# Altium schematic sheet Output_Digital.SchDoc
size A4
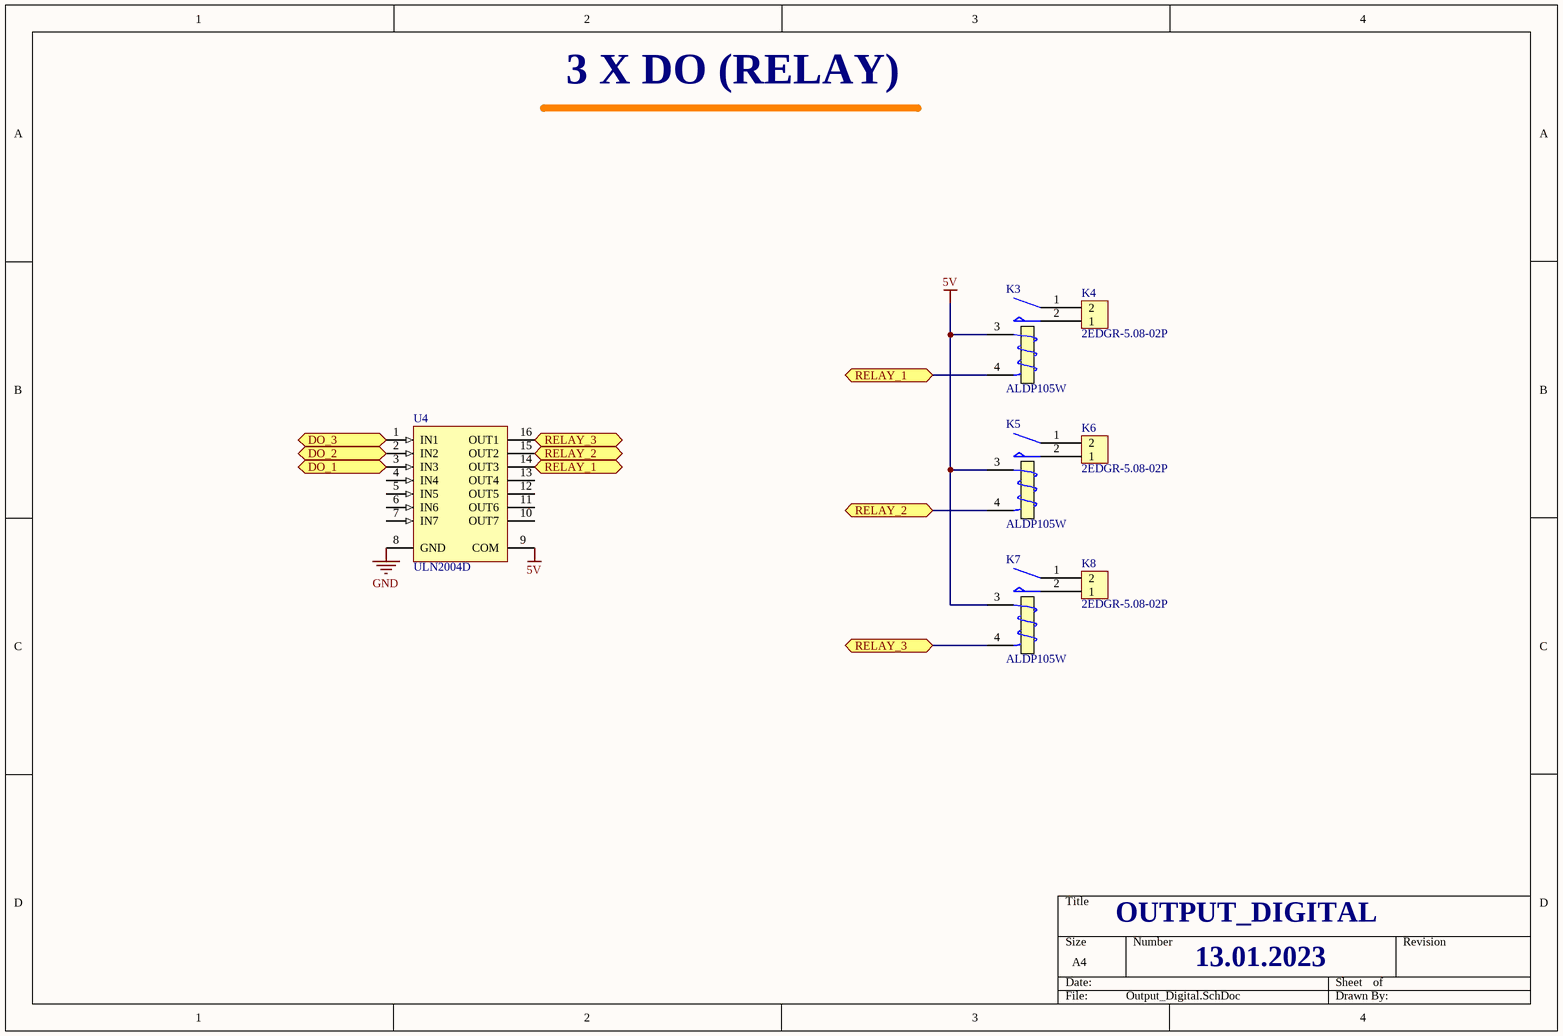
[diagram p0: Output_Digital.SchDoc]

## Parts
K3  ALDP105W  [RELAY_ALDP124W]
K4  2EDGR-5.08-02P  [CON_DG129_02P]
K5  ALDP105W  [RELAY_ALDP124W]
K6  2EDGR-5.08-02P  [CON_DG129_02P]
K7  ALDP105W  [RELAY_ALDP124W]
K8  2EDGR-5.08-02P  [CON_DG129_02P]
U4  ULN2004D  [SO16_M]

## Ports
DO_1, DO_2, DO_3, RELAY_1, RELAY_2, RELAY_3

## Nets
5V: K3.3(T1) K5.3(T1) K7.3(T1) U4.9(COM)
GND: U4.8(GND)
DO_1: U4.3(IN3) ; port DO_1
DO_2: U4.2(IN2) ; port DO_2
DO_3: U4.1(IN1) ; port DO_3
RELAY_1: K3.4(T2) U4.14(OUT3) ; port RELAY_1
RELAY_2: K5.4(T2) U4.15(OUT2) ; port RELAY_2
RELAY_3: K7.4(T2) U4.16(OUT1) ; port RELAY_3
NetK3_1: K3.1(COM) K4.2
NetK3_2: K3.2(NO) K4.1
NetK5_1: K5.1(COM) K6.2
NetK5_2: K5.2(NO) K6.1
NetK7_1: K7.1(COM) K8.2
NetK7_2: K7.2(NO) K8.1

Not connected (* = marked no-connect by the designer): U4 4(IN4) 5(IN5) 6(IN6) 7(IN7) 10(OUT7) 11(OUT6) 12(OUT5) 13(OUT4)

## Notes on the sheet
- 3 X DO (RELAY)
- OUTPUT_DIGITAL
- 13.01.2023

## Library data of the parts
K3 K5 K7 = RELAY_ALDP124W: RELAY PANASONIC ALDP105W 5A; Published: 8-Jun-2000; LatestRevisionDate: 17-Jul-2002; LatestRevisionNote: Re-released for DXP Platform.; PackageReference: MODULE5B; Publisher: Altium Limited
K4 K6 K8 = KLEMENS_2P: CONNECTOR 5.08mm 2PIN 90DEG
U4 = ULN2004D: IC Seven Darlington Array Integrated suppression diodes for inductive  loads; Published: 8-Jun-2000; LatestRevisionDate: 13-Apr-2006; LatestRevisionNote: IPC-7351 Footprint Added.; DatasheetVersion: Sep-1998; PackageVersion: May-1998; PackageReference: SO16; Publisher: Altium Limited; PackageDescription: 16-Pin Small Outline Integrated Circuit 1.27 mm Pitch; Code_IPC: SOIC127P600-16; ComponentLink1Description: Manufacturer Link; ComponentLink1URL: http://www.st.com/; ComponentLink2Description: Datasheet; ComponentLink2URL: http://www.st.com/stonline/products/literature/ds/5279/uln2001.pdf